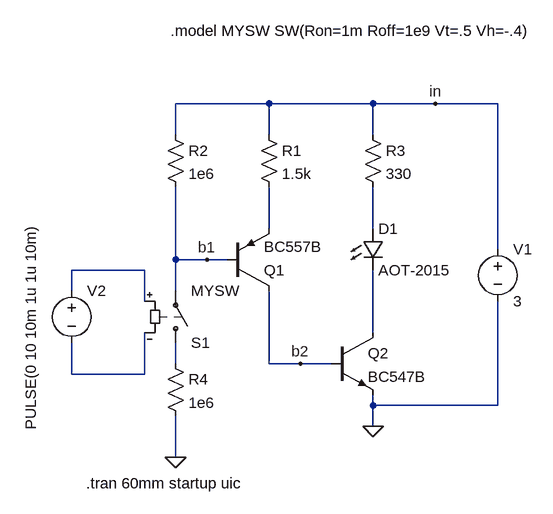
[diagram p0: schematic Draft2.asc]
Draft2.asc, the LTspice schematic file:
Version 4
SHEET 1 880 680
WIRE 144 -16 0 -16
WIRE 304 -16 144 -16
WIRE 400 -16 304 -16
WIRE 496 -16 400 -16
WIRE 0 32 0 -16
WIRE 144 32 144 -16
WIRE 304 32 304 -16
WIRE 144 176 144 112
WIRE 304 176 304 112
WIRE 496 208 496 -16
WIRE 0 224 0 112
WIRE 48 224 0 224
WIRE 80 224 48 224
WIRE -48 240 -160 240
WIRE -160 272 -160 240
WIRE 0 272 0 224
WIRE -48 288 -48 240
WIRE 304 336 304 240
WIRE 0 384 0 352
WIRE 144 384 144 272
WIRE 192 384 144 384
WIRE 240 384 192 384
WIRE -160 400 -160 352
WIRE -48 400 -48 336
WIRE -48 400 -160 400
WIRE 304 448 304 432
WIRE 496 448 496 288
WIRE 496 448 304 448
WIRE 304 480 304 448
WIRE 0 528 0 464
FLAG 304 480 0
FLAG 400 -16 in
FLAG 192 384 b2
FLAG 48 224 b1
FLAG 0 528 0
SYMBOL pnp 80 272 M180
SYMATTR InstName Q1
SYMATTR Value BC557B
SYMBOL res 128 16 R0
SYMATTR InstName R1
SYMATTR Value 1.5k
SYMBOL res -16 16 R0
SYMATTR InstName R2
SYMATTR Value 1e6
SYMBOL npn 240 336 R0
SYMATTR InstName Q2
SYMATTR Value BC547B
SYMBOL LED 288 176 R0
SYMATTR InstName D1
SYMATTR Value AOT-2015
SYMBOL res 288 16 R0
SYMATTR InstName R3
SYMATTR Value 330
SYMBOL voltage 496 192 R0
WINDOW 123 0 0 Left 0
WINDOW 39 0 0 Left 0
SYMATTR InstName V1
SYMATTR Value 3
SYMBOL sw 0 368 M180
SYMATTR InstName S1
SYMATTR Value MYSW
SYMBOL res -16 368 R0
SYMATTR InstName R4
SYMATTR Value 1e6
SYMBOL voltage -160 256 R0
WINDOW 3 -63 -87 VRight 2
WINDOW 123 0 0 Left 0
WINDOW 39 0 0 Left 0
SYMATTR InstName V2
SYMATTR Value PULSE(0 10 10m 1u 1u 10m)
TEXT -138 568 Left 2 !.tran 60mm startup uic
TEXT -8 -128 Left 2 !.model MYSW SW(Ron=1m Roff=1e9 Vt=.5 Vh=-.4)

The netlist it stands for:
* Draft2.asc
Q1 b2 b1 N001 0 BC557B
R1 in N001 1.5k
R2 in b1 1e6
Q2 N004 b2 0 0 BC547B
D1 N002 N004 AOT-2015
R3 in N002 330
V1 in 0 3
S1 N005 b1 N003 N006 MYSW
R4 N005 0 1e6
V2 N003 N006 PULSE(0 10 10m 1u 1u 10m)
.model D D
.lib standard.dio
.model NPN NPN
.model PNP PNP
.lib standard.bjt
.tran 60mm startup uic
.model MYSW SW(Ron=1m Roff=1e9 Vt=.5 Vh=-.4)
.backanno
.end